# Altium schematic sheet 0267_GPU_VCCGT VREG PHA.SchDoc
size 848 x 558 mm
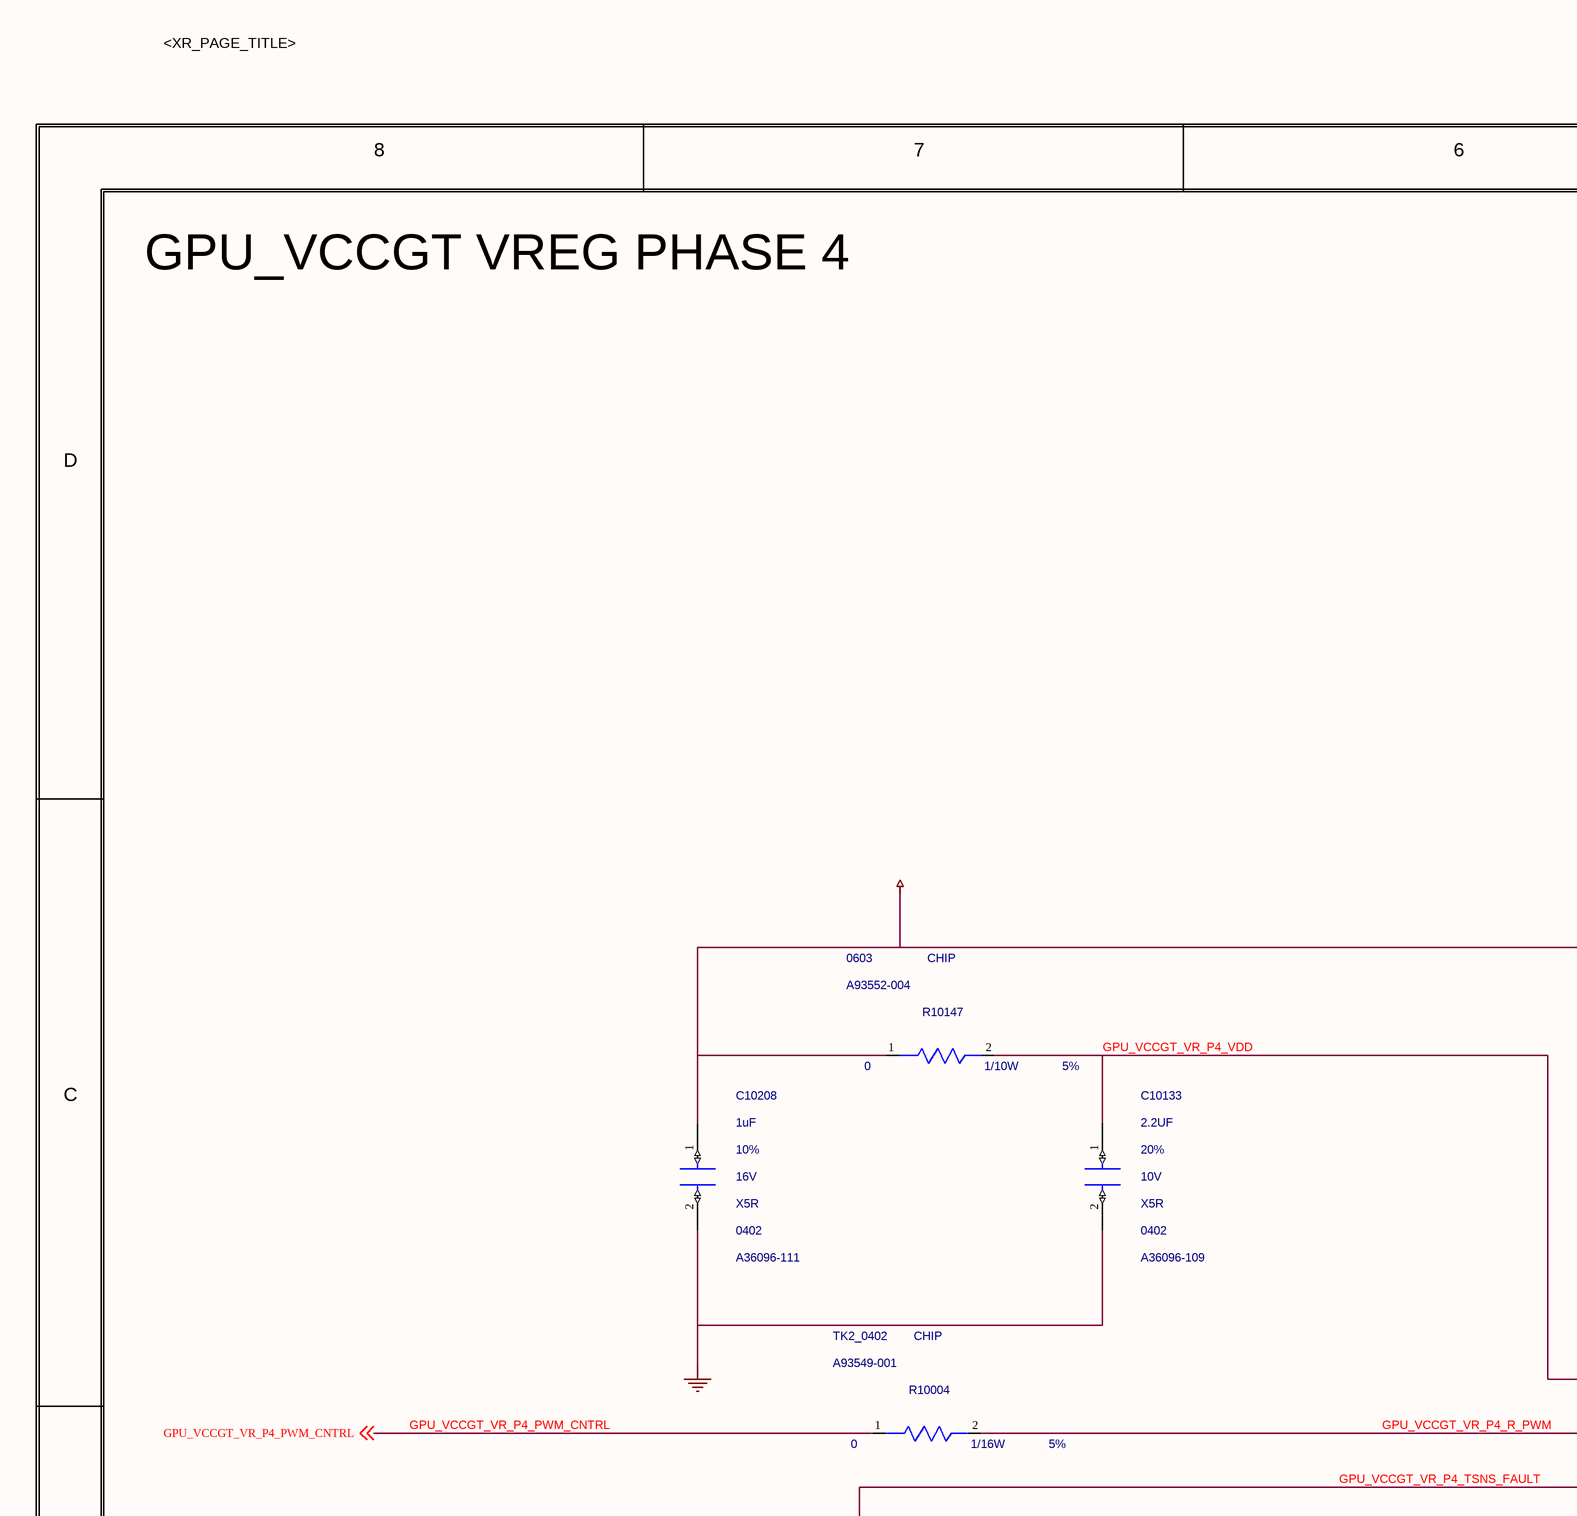
[diagram p0: 0267_GPU_VCCGT VREG PHA.SchDoc, top left]
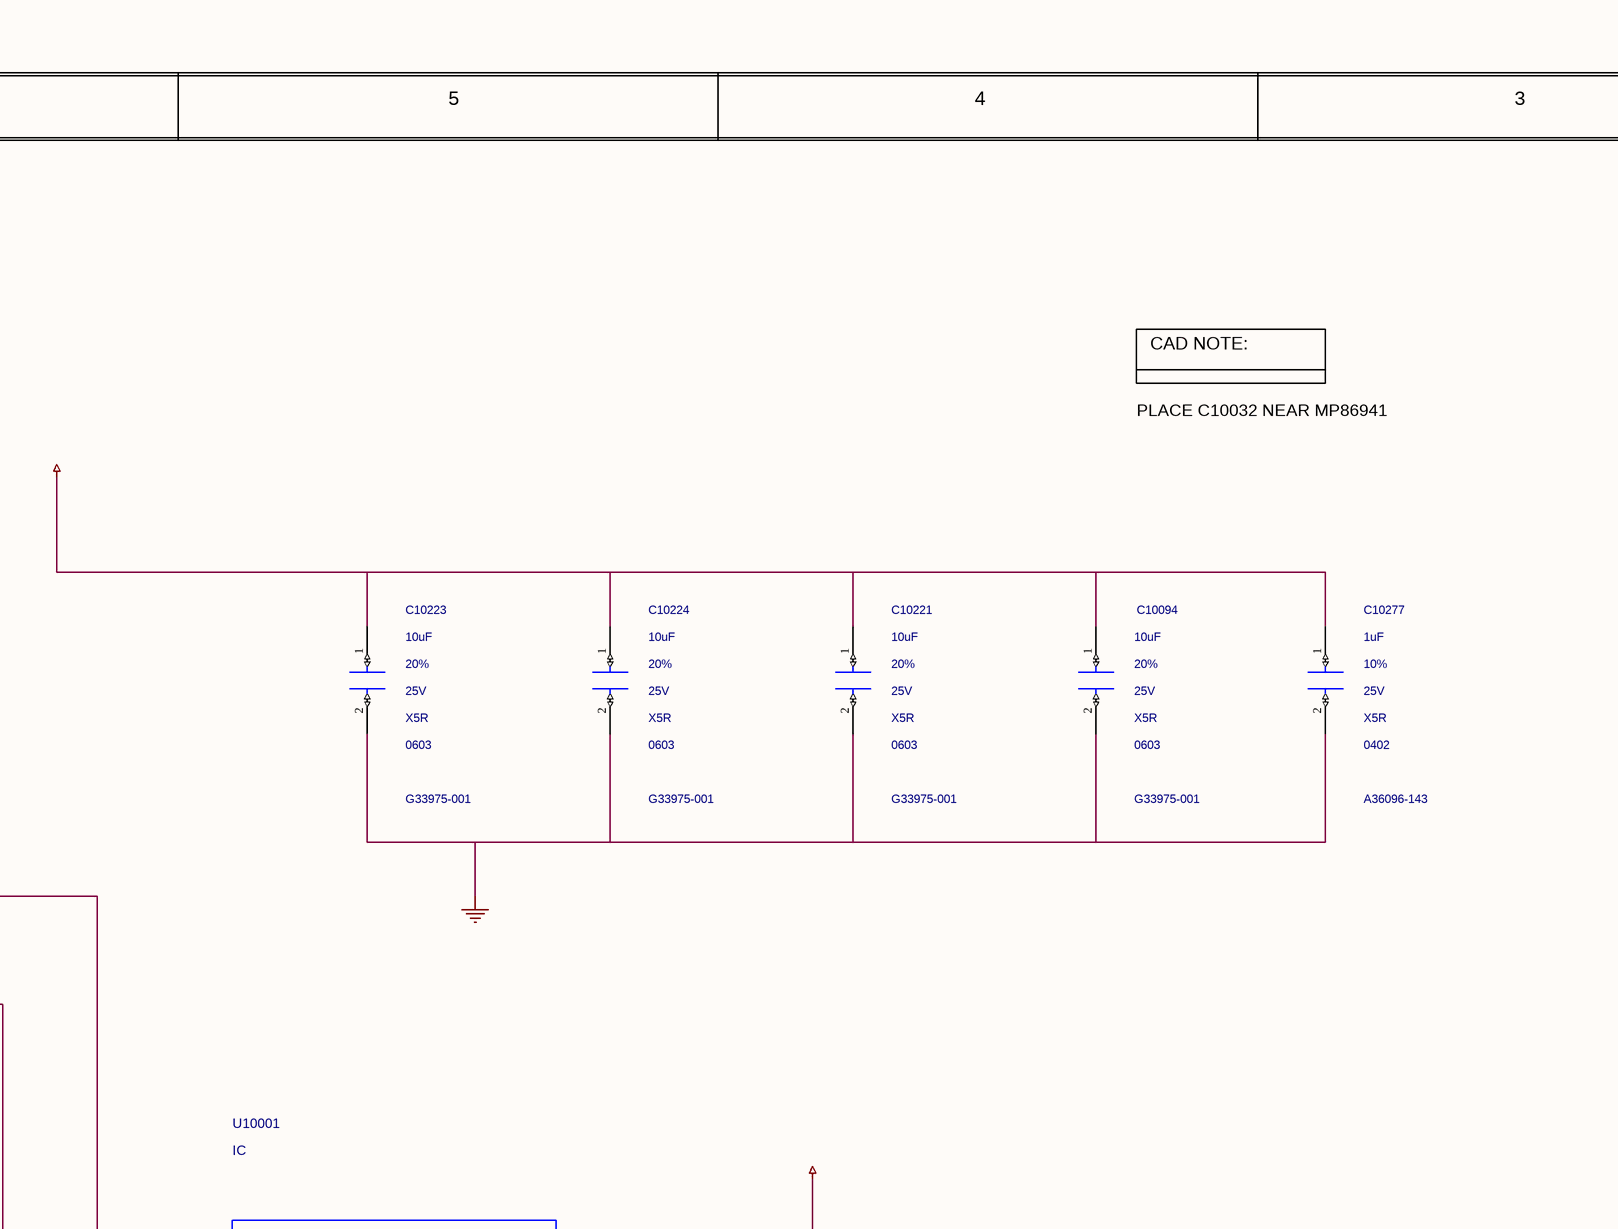
[diagram p1: 0267_GPU_VCCGT VREG PHA.SchDoc, top middle]
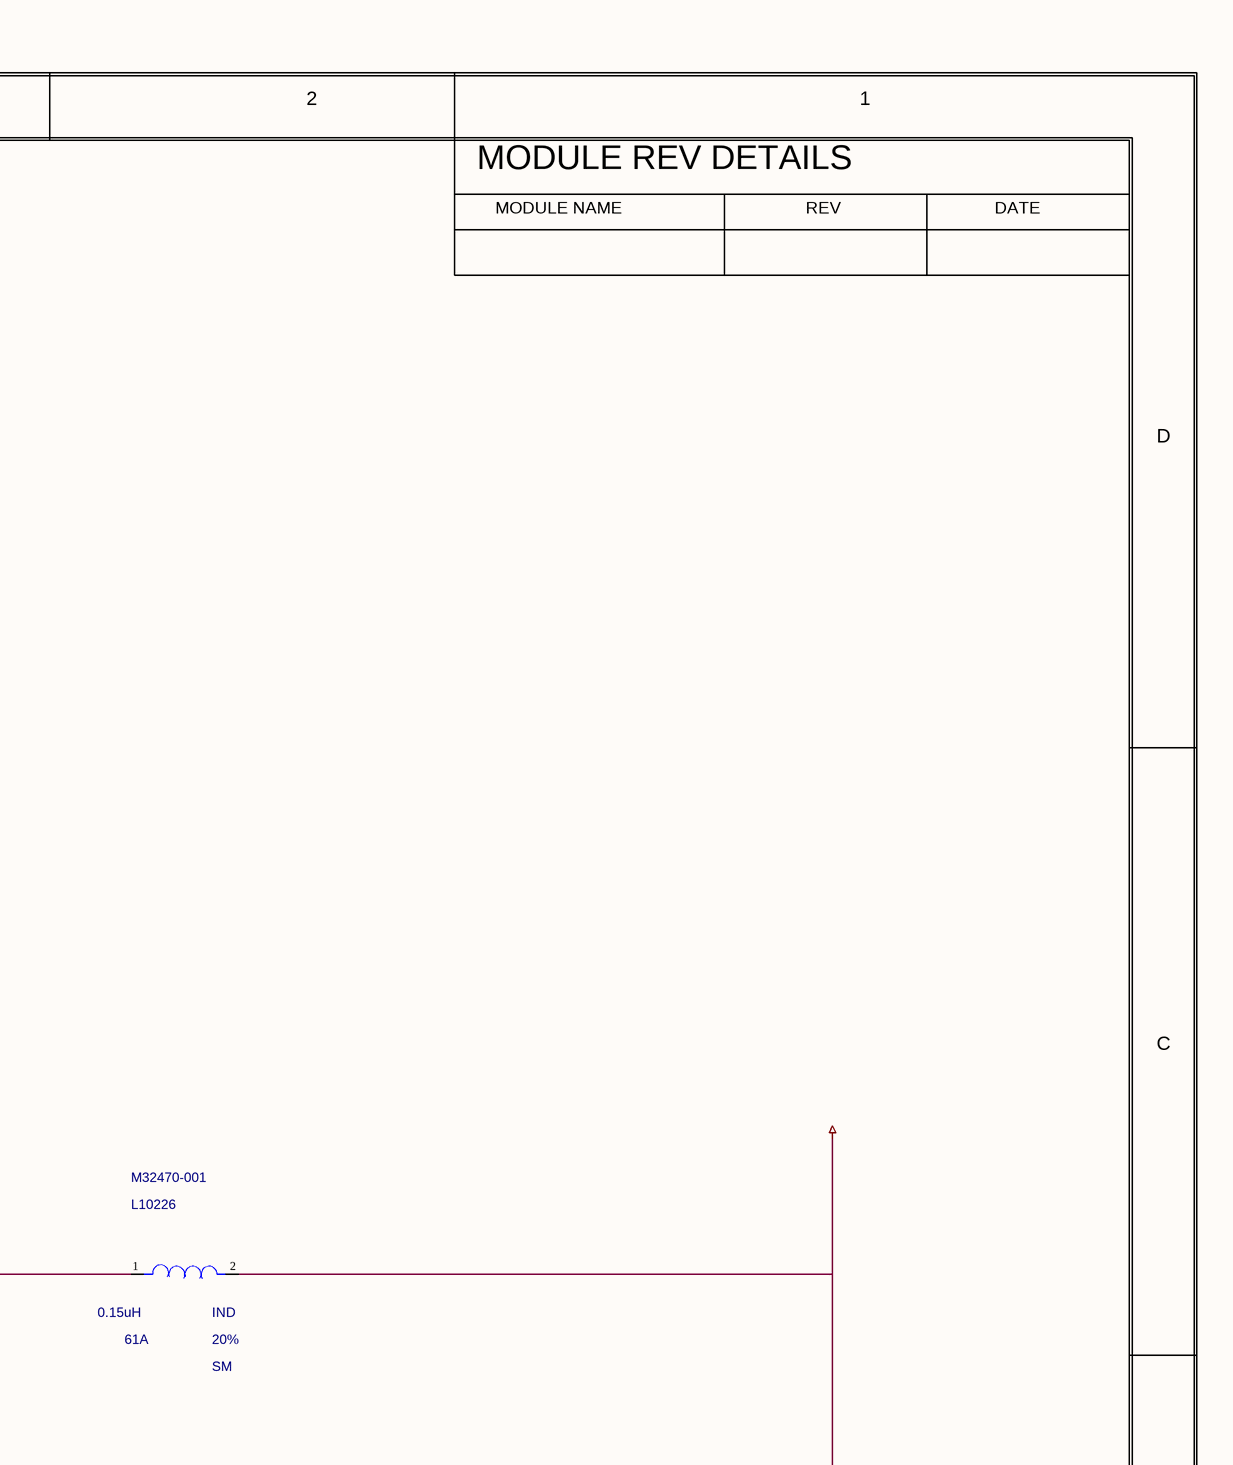
[diagram p2: 0267_GPU_VCCGT VREG PHA.SchDoc, top right]
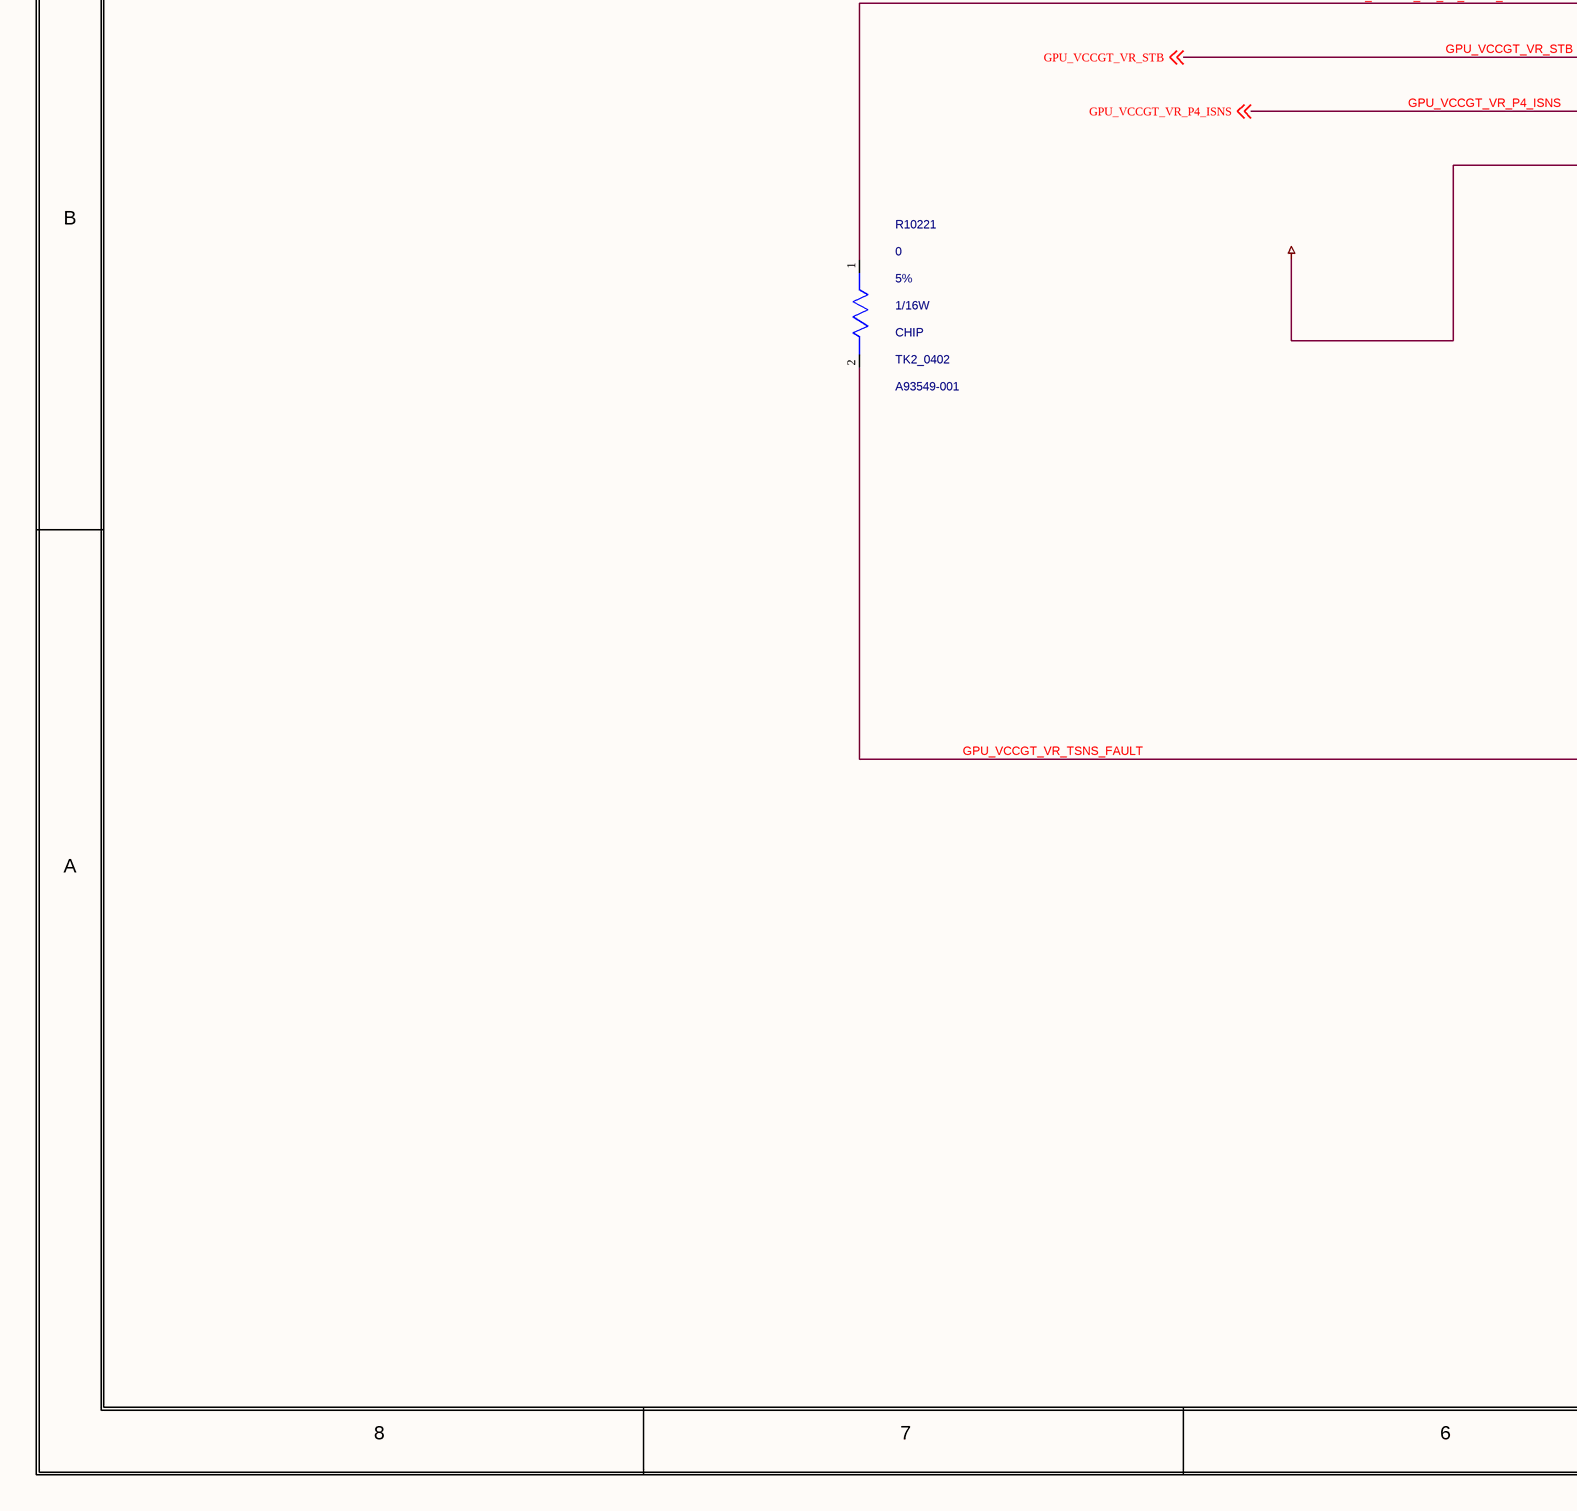
[diagram p3: 0267_GPU_VCCGT VREG PHA.SchDoc, bottom left]
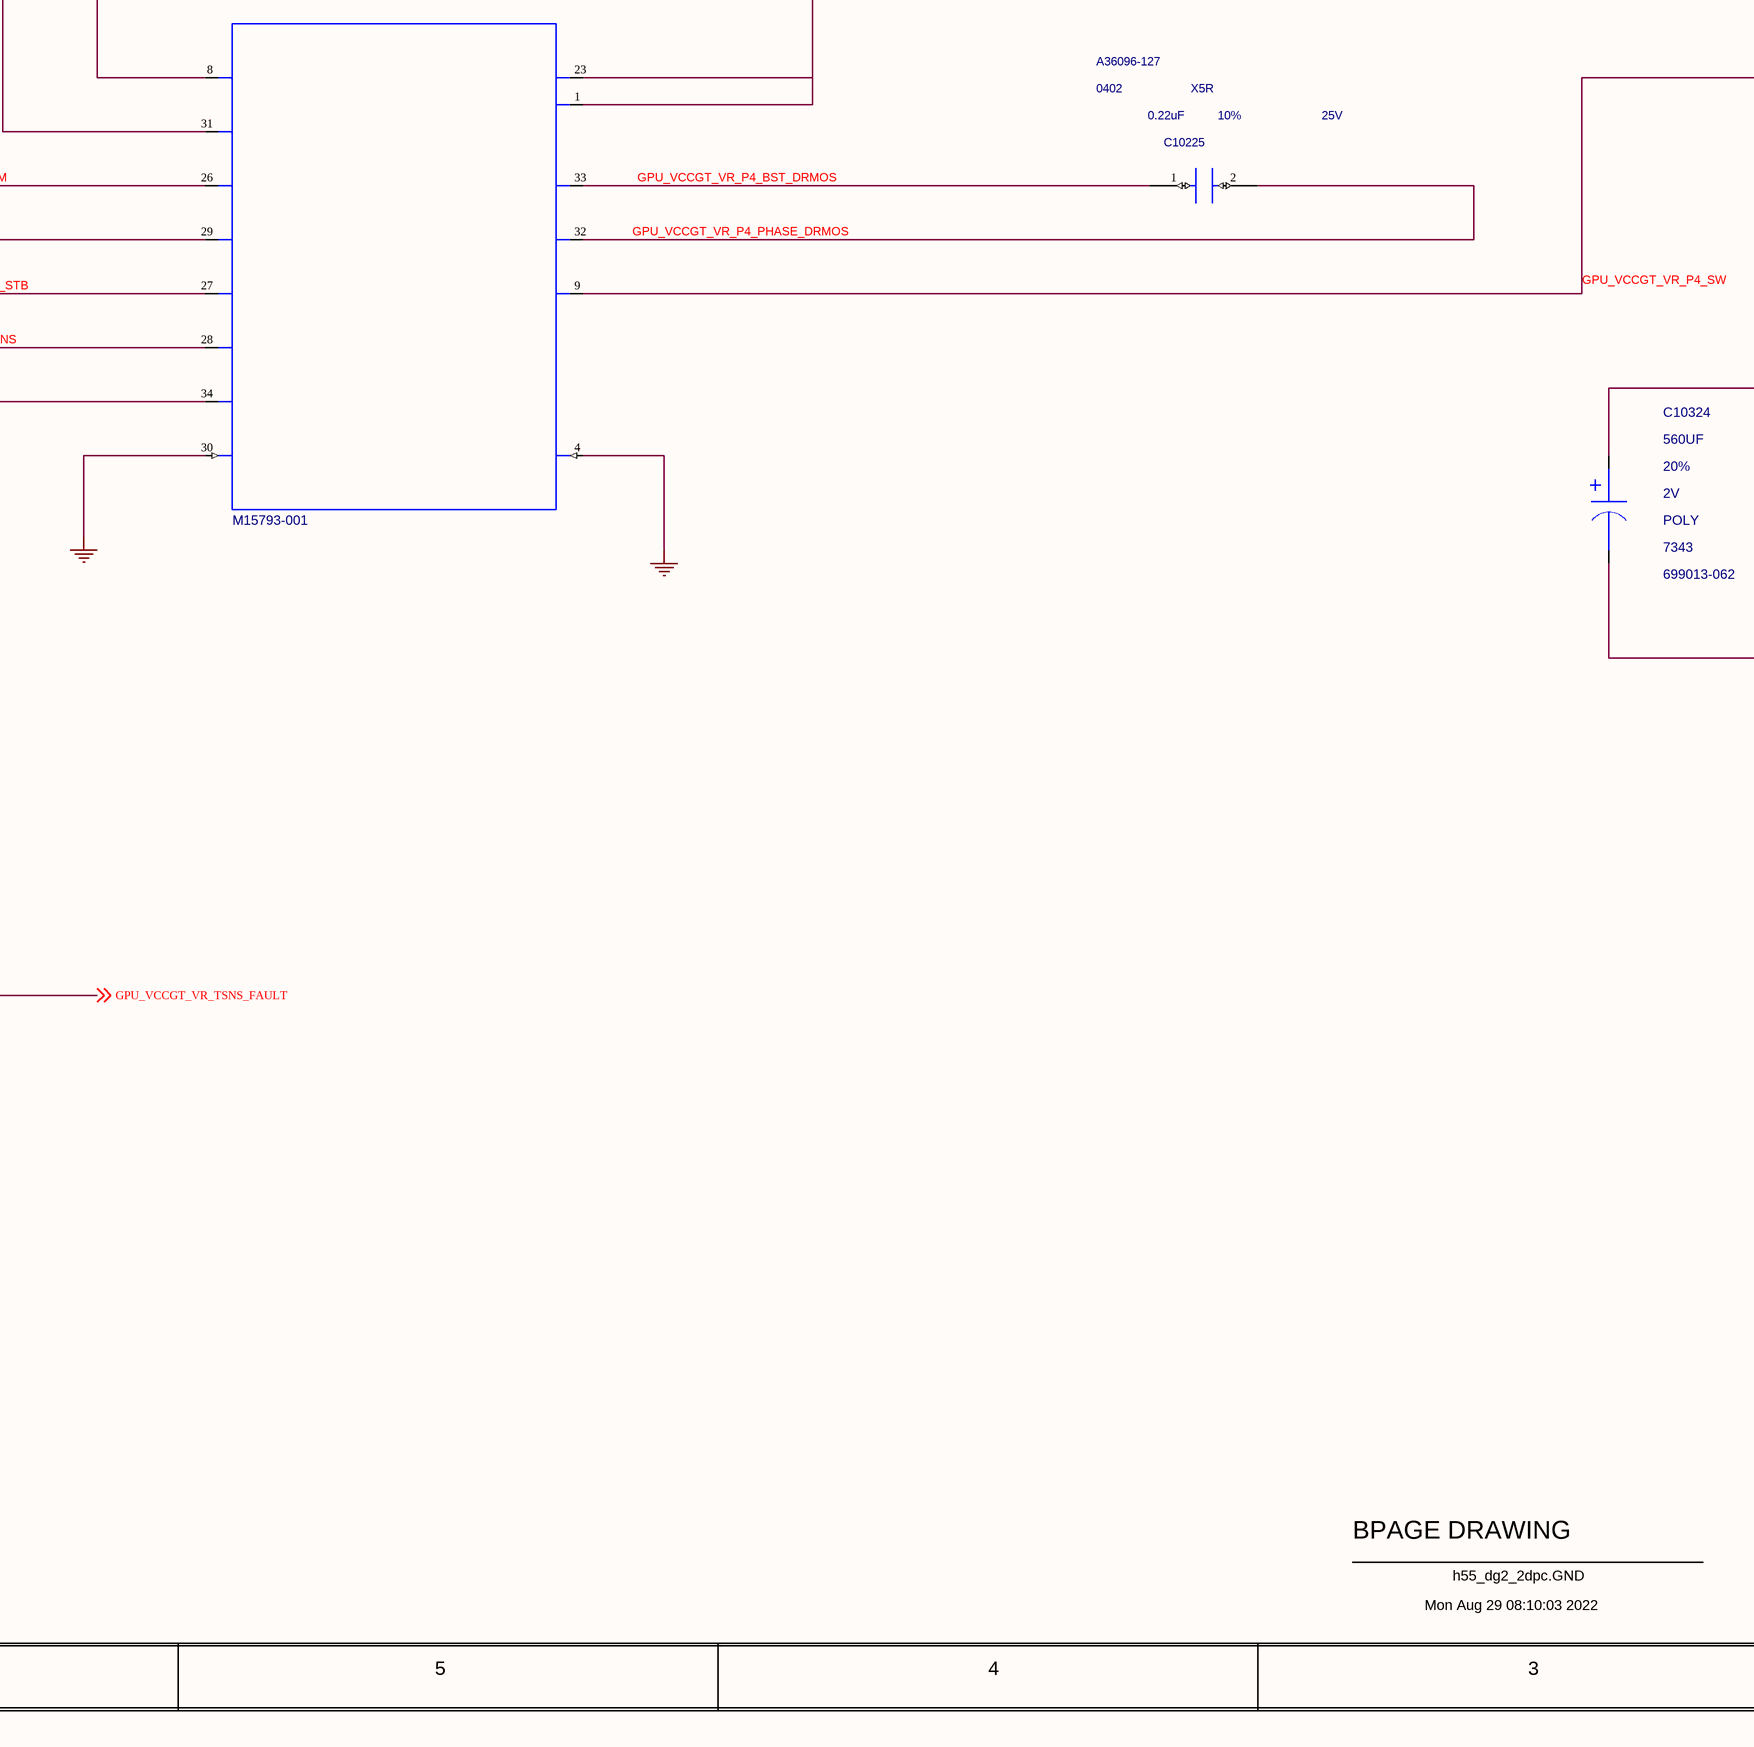
[diagram p4: 0267_GPU_VCCGT VREG PHA.SchDoc, bottom middle]
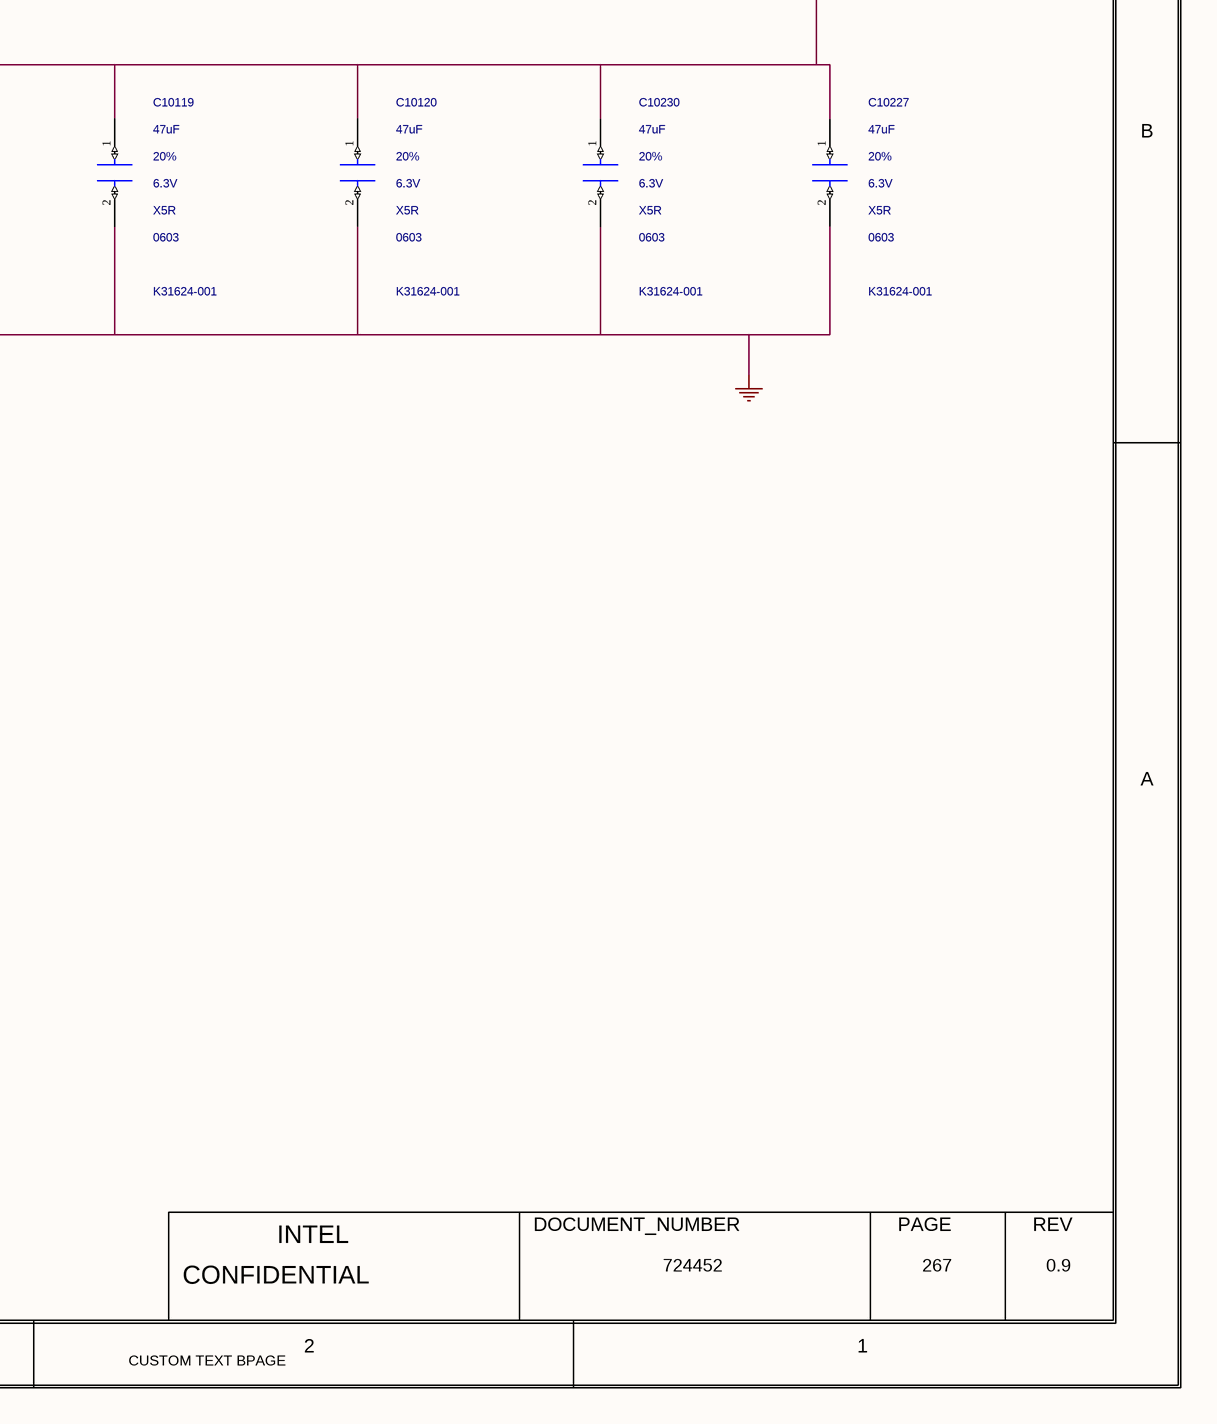
[diagram p5: 0267_GPU_VCCGT VREG PHA.SchDoc, bottom right]

## Parts
C10094  10uF  MATERIAL: X5R  PACK_TYPE: 0603  PART_NUMBER: G33975-001  TOLERANCE: 20%  VOLTAGE: 25V  [SMC0603IA]
C10119  47uF  MATERIAL: X5R  PACK_TYPE: 0603  PART_NUMBER: K31624-001  TOLERANCE: 20%  VOLTAGE: 6.3V  [SMC0603ID]
C10120  47uF  MATERIAL: X5R  PACK_TYPE: 0603  PART_NUMBER: K31624-001  TOLERANCE: 20%  VOLTAGE: 6.3V  [SMC0603ID]
C10133  2.2UF  MATERIAL: X5R  PACK_TYPE: 0402  PART_NUMBER: A36096-109  TOLERANCE: 20%  VOLTAGE: 10V  [SMC0402IA]
C10208  1uF  MATERIAL: X5R  PACK_TYPE: 0402  PART_NUMBER: A36096-111  TOLERANCE: 10%  VOLTAGE: 16V  [SMC0402IA]
C10221  10uF  MATERIAL: X5R  PACK_TYPE: 0603  PART_NUMBER: G33975-001  TOLERANCE: 20%  VOLTAGE: 25V  [SMC0603IA]
C10223  10uF  MATERIAL: X5R  PACK_TYPE: 0603  PART_NUMBER: G33975-001  TOLERANCE: 20%  VOLTAGE: 25V  [SMC0603IA]
C10224  10uF  MATERIAL: X5R  PACK_TYPE: 0603  PART_NUMBER: G33975-001  TOLERANCE: 20%  VOLTAGE: 25V  [SMC0603IA]
C10225  0.22uF  MATERIAL: X5R  PACK_TYPE: 0402  PART_NUMBER: A36096-127  TOLERANCE: 10%  VOLTAGE: 25V  [SMC1005MB]
C10227  47uF  MATERIAL: X5R  PACK_TYPE: 0603  PART_NUMBER: K31624-001  TOLERANCE: 20%  VOLTAGE: 6.3V  [SMC0603ID]
C10230  47uF  MATERIAL: X5R  PACK_TYPE: 0603  PART_NUMBER: K31624-001  TOLERANCE: 20%  VOLTAGE: 6.3V  [SMC0603ID]
C10277  1uF  MATERIAL: X5R  PACK_TYPE: 0402  PART_NUMBER: A36096-143  TOLERANCE: 10%  VOLTAGE: 25V  [SMC0402MA]
C10324  560UF  MATERIAL: POLY  PACK_TYPE: 7343  PART_NUMBER: 699013-062  TOLERANCE: 20%  VOLTAGE: 2V  [CTK0_SMC7343M_7500X4500_TANT_MA]
L10226  0.15uH  CURRENT: 61A  MATERIAL: IND  PACK_TYPE: SM  PART_NUMBER: M32470-001  TOLERANCE: 20%  [CTK2_SM_7300X6800_MA]
R10004  0  MATERIAL: CHIP  PACK_TYPE: TK2_0402  PART_NUMBER: A93549-001  TOLERANCE: 5%  WATTAGE: 1/16W  [SMR1005MB]
R10147  0  MATERIAL: CHIP  PACK_TYPE: 0603  PART_NUMBER: A93552-004  TOLERANCE: 5%  WATTAGE: 1/10W  [SMR0603IA]
R10221  0  MATERIAL: CHIP  PACK_TYPE: TK2_0402  PART_NUMBER: A93549-001  TOLERANCE: 5%  WATTAGE: 1/16W  [SMR1005MB]
U10001  MATERIAL: IC  PART_NUMBER: M15793-001  [CTK1_LCC34_4100X6100_450_DF4P_MA_VR]  (hidden comment: C_MP86959)

## Nets
+V3P3S_GPU: C10208.1(A) R10147.1(A) U10001.8(VDRV) U10001.34(TEST)
+VBATA_VCCGT_GPU: C10094.1(A) C10221.1(A) C10223.1(A) C10224.1(A) C10277.1(A) U10001.1(VIN_1) U10001.23(VIN_2)
+VCCGT_GPU: C10119.1(A) C10120.1(A) C10227.1(A) C10230.1(A) C10324.1(A) L10226.2(INB)
GND: C10094.2(B) C10119.2(B) C10120.2(B) C10133.2(B) C10208.2(B) C10221.2(B) C10223.2(B) C10224.2(B) C10227.2(B) C10230.2(B) C10277.2(B) C10324.2(B) U10001.4(PGND) U10001.30(AGND)
GPU_VCCGT_VR_P4_BST_DRMOS: C10225.1(A) U10001.33(BST)
GPU_VCCGT_VR_P4_ISNS: U10001.28(CS) ; off-sheet GPU_VCCGT_VR_P4_ISNS
GPU_VCCGT_VR_P4_PHASE_DRMOS: C10225.2(B) U10001.32(PHASE)
GPU_VCCGT_VR_P4_PWM_CNTRL: R10004.1(A) ; off-sheet GPU_VCCGT_VR_P4_PWM_CNTRL
GPU_VCCGT_VR_P4_R_PWM: R10004.2(B) U10001.26(PWM)
GPU_VCCGT_VR_P4_SW: L10226.1(INA) U10001.9(SW)
GPU_VCCGT_VR_P4_TSNS_FAULT: R10221.1(A) U10001.29(VTEMP_FLT)
GPU_VCCGT_VR_P4_VDD: C10133.1(A) R10147.2(B) U10001.31(VDD)
GPU_VCCGT_VR_STB: U10001.27(SYNC) ; off-sheet GPU_VCCGT_VR_STB
GPU_VCCGT_VR_TSNS_FAULT: R10221.2(B) ; off-sheet GPU_VCCGT_VR_TSNS_FAULT

## Notes on the sheet
- <XR_PAGE_TITLE>
- 8
- 7
- 6
- 5
- 4
- 3
- 2
- 1
- MODULE REV DETAILS
- GPU_VCCGT VREG PHASE 4
- MODULE NAME
- REV
- DATE
- CAD NOTE:
- D
- PLACE C10032 NEAR MP86941
- C
- B
- A
- BPAGE DRAWING
- INTEL
- DOCUMENT_NUMBER
- PAGE
- Mon Aug 29 08:10:03 2022
- h55_dg2_2dpc.GND
- CONFIDENTIAL
- 724452
- 267
- 0.9
- CUSTOM TEXT BPAGE

## Library data of the parts
C10094 = CAP: CDS_PHYS_PART_NAME: CAP_0603-G33975-001,X5R,10UF,25V,20%,LPDB,GENERIC; OriginalSymbolOrigin: (-50,25); XY: (1950,2700); VER: 1; ROT: 0; PHYS_PAGE: 267; LOCATION: C10094; DRAWING: @RVP1_ADL_SB_ADP_S_DDR5_SODIMM_2DPC_LIB.H55_DG2_2DPC(SCH_1):PAGE440; CDS_LIB: discrete; PCB Footprint: SMC0603IA; CHIPS_PART_NAME: CAP; CDS_PART_NAME: CAP_0603-G33975-001,X5R,10UF,25V,20%,LPDB,GENERIC; CDS_LOCATION: C10094
C10119 = CAP: CDS_PHYS_PART_NAME: CAP_0603-K31624-001,X5R,47UF,6.3V,20%,LPDB,GENERIC; OriginalSymbolOrigin: (-50,25); XY: (3400,825); VER: 1; ROT: 0; PHYS_PAGE: 267; LOCATION: C10119; DRAWING: @RVP1_ADL_SB_ADP_S_DDR5_SODIMM_2DPC_LIB.H55_DG2_2DPC(SCH_1):PAGE440; CDS_LIB: discrete; PCB Footprint: SMC0603ID; CHIPS_PART_NAME: CAP; CDS_PART_NAME: CAP_0603-K31624-001,X5R,47UF,6.3V,20%,LPDB,GENERIC; CDS_LOCATION: C10119
C10120 = CAP: CDS_PHYS_PART_NAME: CAP_0603-K31624-001,X5R,47UF,6.3V,20%,LPDB,GENERIC; OriginalSymbolOrigin: (-50,25); XY: (3850,825); VER: 1; ROT: 0; PHYS_PAGE: 267; LOCATION: C10120; DRAWING: @RVP1_ADL_SB_ADP_S_DDR5_SODIMM_2DPC_LIB.H55_DG2_2DPC(SCH_1):PAGE440; CDS_LIB: discrete; PCB Footprint: SMC0603ID; CHIPS_PART_NAME: CAP; CDS_PART_NAME: CAP_0603-K31624-001,X5R,47UF,6.3V,20%,LPDB,GENERIC; CDS_LOCATION: C10120
C10133 = CAP: CDS_PHYS_PART_NAME: CAP_0402-A36096-109,X5R,2.2UF,10V,20%,LPDB,GENERIC; OriginalSymbolOrigin: (-50,25); XY: (-900,1875); VER: 1; ROT: 0; PHYS_PAGE: 267; LOCATION: C10133; DRAWING: @RVP1_ADL_SB_ADP_S_DDR5_SODIMM_2DPC_LIB.H55_DG2_2DPC(SCH_1):PAGE440; CDS_LIB: discrete; PCB Footprint: SMC0402IA; CHIPS_PART_NAME: CAP; CDS_PART_NAME: CAP_0402-A36096-109,X5R,2.2UF,10V,20%,LPDB,GENERIC; CDS_LOCATION: C10133
C10208 = CAP: CDS_PHYS_PART_NAME: CAP_0402-A36096-111,X5R,1UF,16V,10%,LPDB,GENERIC; OriginalSymbolOrigin: (-50,25); XY: (-1650,1875); VER: 1; ROT: 0; PHYS_PAGE: 267; LOCATION: C10208; DRAWING: @RVP1_ADL_SB_ADP_S_DDR5_SODIMM_2DPC_LIB.H55_DG2_2DPC(SCH_1):PAGE440; CDS_LIB: discrete; PCB Footprint: SMC0402IA; CHIPS_PART_NAME: CAP; CDS_PART_NAME: CAP_0402-A36096-111,X5R,1UF,16V,10%,LPDB,GENERIC; CDS_LOCATION: C10208
C10221 = CAP: CDS_PHYS_PART_NAME: CAP_0603-G33975-001,X5R,10UF,25V,20%,LPDB,GENERIC; OriginalSymbolOrigin: (-50,25); XY: (1500,2700); VER: 1; ROT: 0; PHYS_PAGE: 267; LOCATION: C10221; DRAWING: @RVP1_ADL_SB_ADP_S_DDR5_SODIMM_2DPC_LIB.H55_DG2_2DPC(SCH_1):PAGE440; CDS_LIB: discrete; PCB Footprint: SMC0603IA; CHIPS_PART_NAME: CAP; CDS_PART_NAME: CAP_0603-G33975-001,X5R,10UF,25V,20%,LPDB,GENERIC; CDS_LOCATION: C10221
C10223 = CAP: CDS_PHYS_PART_NAME: CAP_0603-G33975-001,X5R,10UF,25V,20%,LPDB,GENERIC; OriginalSymbolOrigin: (-50,25); XY: (600,2700); VER: 1; ROT: 0; PHYS_PAGE: 267; LOCATION: C10223; DRAWING: @RVP1_ADL_SB_ADP_S_DDR5_SODIMM_2DPC_LIB.H55_DG2_2DPC(SCH_1):PAGE440; CDS_LIB: discrete; PCB Footprint: SMC0603IA; CHIPS_PART_NAME: CAP; CDS_PART_NAME: CAP_0603-G33975-001,X5R,10UF,25V,20%,LPDB,GENERIC; CDS_LOCATION: C10223
C10224 = CAP: CDS_PHYS_PART_NAME: CAP_0603-G33975-001,X5R,10UF,25V,20%,LPDB,GENERIC; OriginalSymbolOrigin: (-50,25); XY: (1050,2700); VER: 1; ROT: 0; PHYS_PAGE: 267; LOCATION: C10224; DRAWING: @RVP1_ADL_SB_ADP_S_DDR5_SODIMM_2DPC_LIB.H55_DG2_2DPC(SCH_1):PAGE440; CDS_LIB: discrete; PCB Footprint: SMC0603IA; CHIPS_PART_NAME: CAP; CDS_PART_NAME: CAP_0603-G33975-001,X5R,10UF,25V,20%,LPDB,GENERIC; CDS_LOCATION: C10224
C10225 = CAP#1: CHIPS_PART_NAME: CAP; CDS_PHYS_PART_NAME: CAP_0402-A36096-127,X5R,0.22UF,25V,10%,LPDB,GENERIC; OriginalSymbolOrigin: (-25,50); XY: (2150,1400); VER: 2; ROT: 0; PHYS_PAGE: 267; LOCATION: C10225; DRAWING: @RVP1_ADL_SB_ADP_S_DDR5_SODIMM_2DPC_LIB.H55_DG2_2DPC(SCH_1):PAGE440; CDS_LIB: discrete; PCB Footprint: SMC1005MB; CDS_PART_NAME: CAP_0402-A36096-127,X5R,0.22UF,25V,10%,LPDB,GENERIC; CDS_LOCATION: C10225
C10227 = CAP: CDS_PHYS_PART_NAME: CAP_0603-K31624-001,X5R,47UF,6.3V,20%,LPDB,GENERIC; OriginalSymbolOrigin: (-50,25); XY: (4725,825); VER: 1; ROT: 0; PHYS_PAGE: 267; LOCATION: C10227; DRAWING: @RVP1_ADL_SB_ADP_S_DDR5_SODIMM_2DPC_LIB.H55_DG2_2DPC(SCH_1):PAGE440; CDS_LIB: discrete; PCB Footprint: SMC0603ID; CHIPS_PART_NAME: CAP; CDS_PART_NAME: CAP_0603-K31624-001,X5R,47UF,6.3V,20%,LPDB,GENERIC; CDS_LOCATION: C10227
C10230 = CAP: CDS_PHYS_PART_NAME: CAP_0603-K31624-001,X5R,47UF,6.3V,20%,LPDB,GENERIC; OriginalSymbolOrigin: (-50,25); XY: (4300,825); VER: 1; ROT: 0; PHYS_PAGE: 267; LOCATION: C10230; DRAWING: @RVP1_ADL_SB_ADP_S_DDR5_SODIMM_2DPC_LIB.H55_DG2_2DPC(SCH_1):PAGE440; CDS_LIB: discrete; PCB Footprint: SMC0603ID; CHIPS_PART_NAME: CAP; CDS_PART_NAME: CAP_0603-K31624-001,X5R,47UF,6.3V,20%,LPDB,GENERIC; CDS_LOCATION: C10230
C10277 = CAP: CDS_PHYS_PART_NAME: CAP_0402-A36096-143,X5R,1UF,25V,10%,LPDB,GENERIC; OriginalSymbolOrigin: (-50,25); XY: (2375,2700); VER: 1; ROT: 0; PHYS_PAGE: 267; LOCATION: C10277; DRAWING: @RVP1_ADL_SB_ADP_S_DDR5_SODIMM_2DPC_LIB.H55_DG2_2DPC(SCH_1):PAGE440; CDS_LIB: discrete; PCB Footprint: SMC0402MA; CHIPS_PART_NAME: CAP; CDS_PART_NAME: CAP_0402-A36096-143,X5R,1UF,25V,10%,LPDB,GENERIC; CDS_LOCATION: C10277
C10324 = C_CAPP: CDS_PHYS_PART_NAME: C_CAPP_7343-699013-062,POLY,560UF,2V,20%,TK0,GENERIC; CDS_LMAN_SYM_OUTLINE: -50,100,50,-50; FP_TECH: TK0; IP: GENERIC; ROOM: NONE; OriginalSymbolOrigin: (-50,75); XY: (2900,800); VER: 1; ROT: 0; PHYS_PAGE: 267; LOCATION: C10324; DRAWING: @RVP1_ADL_SB_ADP_S_DDR5_SODIMM_2DPC_LIB.H55_DG2_2DPC(SCH_1):PAGE440; CDS_LIB: c_discrete; VARIANT: ?; PCB Footprint: CTK0_SMC7343M_7500X4500_TANT_MA; CHIPS_PART_NAME: C_CAPP; CDS_PART_NAME: C_CAPP_7343-699013-062,POLY,560UF,2V,20%,TK0,GENERIC; CDS_LOCATION: C10324
L10226 = C_INDUCTOR: CDS_PHYS_PART_NAME: C_INDUCTOR_SM-M32470-001,IND,0.15UH,20%,61A,TK2,GENERIC; CDS_LMAN_SYM_OUTLINE: -100,50,100,-50; FP_TECH: TK2; IP: GENERIC; ROOM: NONE; OriginalSymbolOrigin: (-75,25); XY: (3500,1600); VER: 1; ROT: 0; PHYS_PAGE: 267; LOCATION: L10226; DRAWING: @RVP1_ADL_SB_ADP_S_DDR5_SODIMM_2DPC_LIB.H55_DG2_2DPC(SCH_1):PAGE440; CDS_LIB: local; VARIANT: ?; PCB Footprint: CTK2_SM_7300X6800_MA; CHIPS_PART_NAME: C_INDUCTOR; CDS_PART_NAME: C_INDUCTOR_SM-M32470-001,IND,0.15UH,20%,61A,TK2,GENERIC; CDS_LOCATION: L10226
R10004 = RES#1: CHIPS_PART_NAME: RES; CDS_PHYS_PART_NAME: RES_TK2_0402-A93549-001,CHIP,0,5%,1/16W,TK2,GENERIC; OriginalSymbolOrigin: (-75,25); XY: (-1225,1400); VER: 1; PHYS_PAGE: 267; LOCATION: R10004; IP: GENERIC; FP_TECH: TK2; DRAWING: @RVP1_ADL_SB_ADP_S_DDR5_SODIMM_2DPC_LIB.H55_DG2_2DPC(SCH_1):PAGE440; CDS_LIB: discrete; PCB Footprint: SMR1005MB; ROT: 0; CDS_PART_NAME: RES_TK2_0402-A93549-001,CHIP,0,5%,1/16W,TK2,GENERIC; CDS_LOCATION: R10004
R10147 = RES#1: CHIPS_PART_NAME: RES; CDS_PHYS_PART_NAME: RES_0603-A93552-004,CHIP,0,5%,1/10W,LPDB,GENERIC; OriginalSymbolOrigin: (-75,25); XY: (-1200,2100); VER: 1; PHYS_PAGE: 267; LOCATION: R10147; IP: GENERIC; FP_TECH: LPDB; DRAWING: @RVP1_ADL_SB_ADP_S_DDR5_SODIMM_2DPC_LIB.H55_DG2_2DPC(SCH_1):PAGE440; CDS_LIB: discrete; PCB Footprint: SMR0603IA; ROT: 0; CDS_PART_NAME: RES_0603-A93552-004,CHIP,0,5%,1/10W,LPDB,GENERIC; CDS_LOCATION: R10147
R10221 = RES: CDS_PHYS_PART_NAME: RES_TK2_0402-A93549-001,CHIP,0,5%,1/16W,TK2,GENERIC; OriginalSymbolOrigin: (-25,75); XY: (-1350,725); VER: 2; SUB_ROOM: VCCSA; PHYS_PAGE: 267; LOCATION: R10221; IP: GENERIC; FP_TECH: TK2; DRAWING: @RVP1_ADL_SB_ADP_S_DDR5_SODIMM_2DPC_LIB.H55_DG2_2DPC(SCH_1):PAGE440; CDS_LIB: discrete; PCB Footprint: SMR1005MB; ROT: 0; CHIPS_PART_NAME: RES; CDS_PART_NAME: RES_TK2_0402-A93549-001,CHIP,0,5%,1/16W,TK2,GENERIC; CDS_LOCATION: R10221
U10001 = C_MP86959: CDS_PHYS_PART_NAME: C_MP86959_LCC-M15793-001,IC,MP86959GMW,TK1,GENERIC; CDS_LMAN_SYM_OUTLINE: -300,450,300,-450; FP_TECH: TK1; IP: GENERIC; PACK_TYPE: LCC; ROOM: NONE; OriginalSymbolOrigin: (-325,450); XY: (650,1250); VER: 1; ROT: 0; PHYS_PAGE: 267; LOCATION: U10001; DRAWING: @RVP1_ADL_SB_ADP_S_DDR5_SODIMM_2DPC_LIB.H55_DG2_2DPC(SCH_1):PAGE440; CDS_LIB: local; VARIANT: ?; PCB Footprint: CTK1_LCC34_4100X6100_450_DF4P_MA_VR; SEC_TYPE: LCC; CHIPS_PART_NAME: C_MP86959; CDS_PART_NAME: C_MP86959_LCC-M15793-001,IC,MP86959GMW,TK1,GENERIC; CDS_LOCATION: U10001